# EAGLE board Arduino-Teensy-v5_PLUS_ESP-12E_4LAYER (EAGLE 8.6.0)
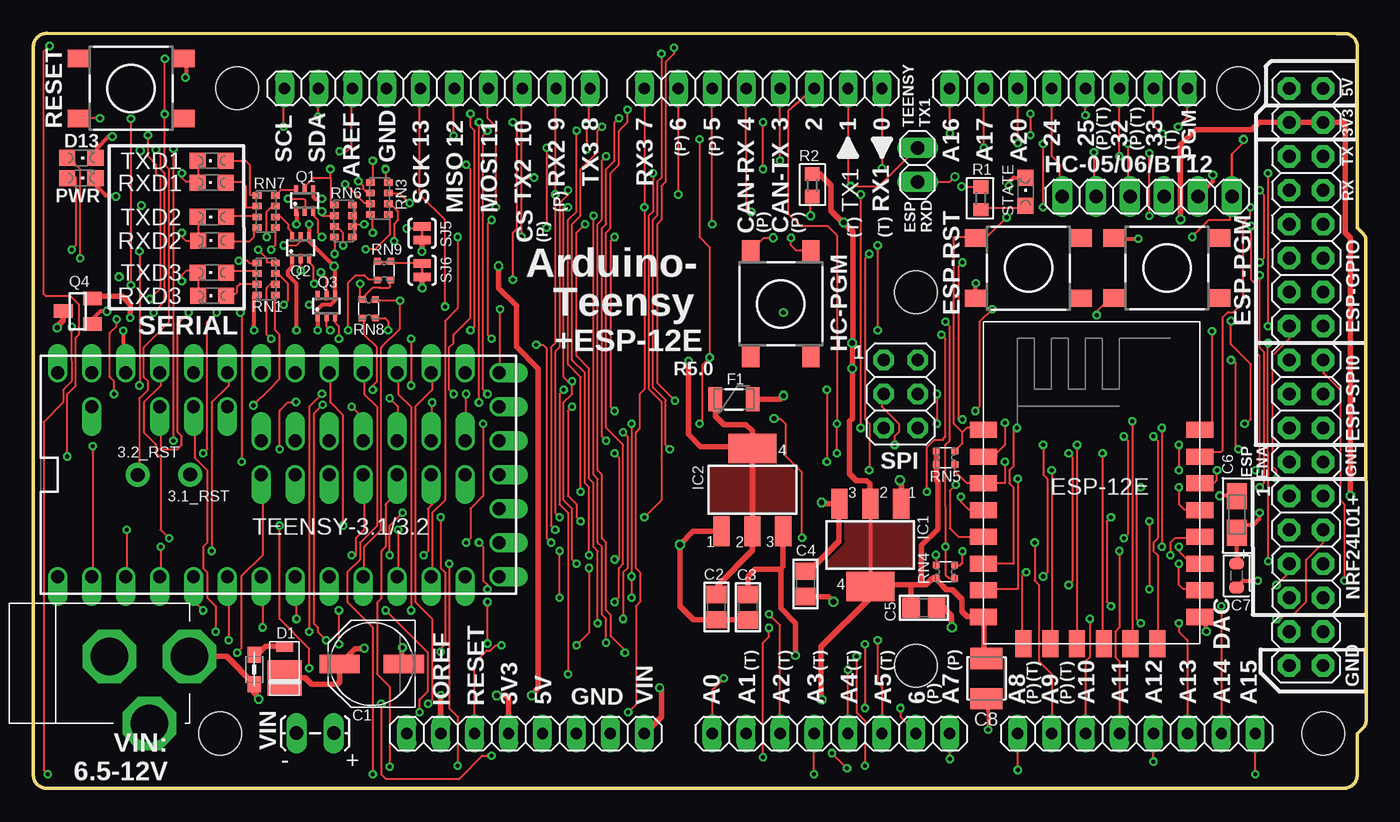
[diagram p1: board, top side]
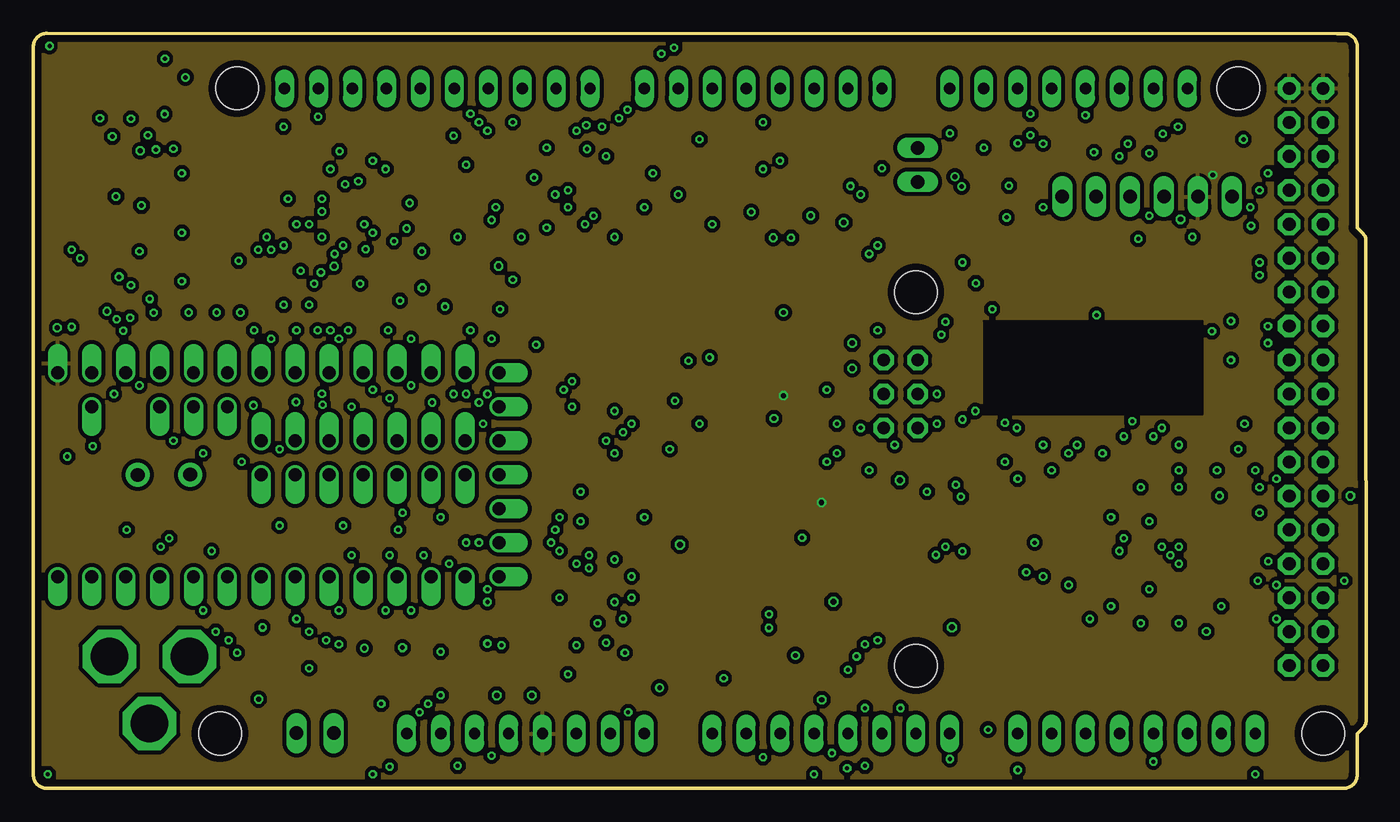
[diagram p2: board, inner layer 5V-FUSE]
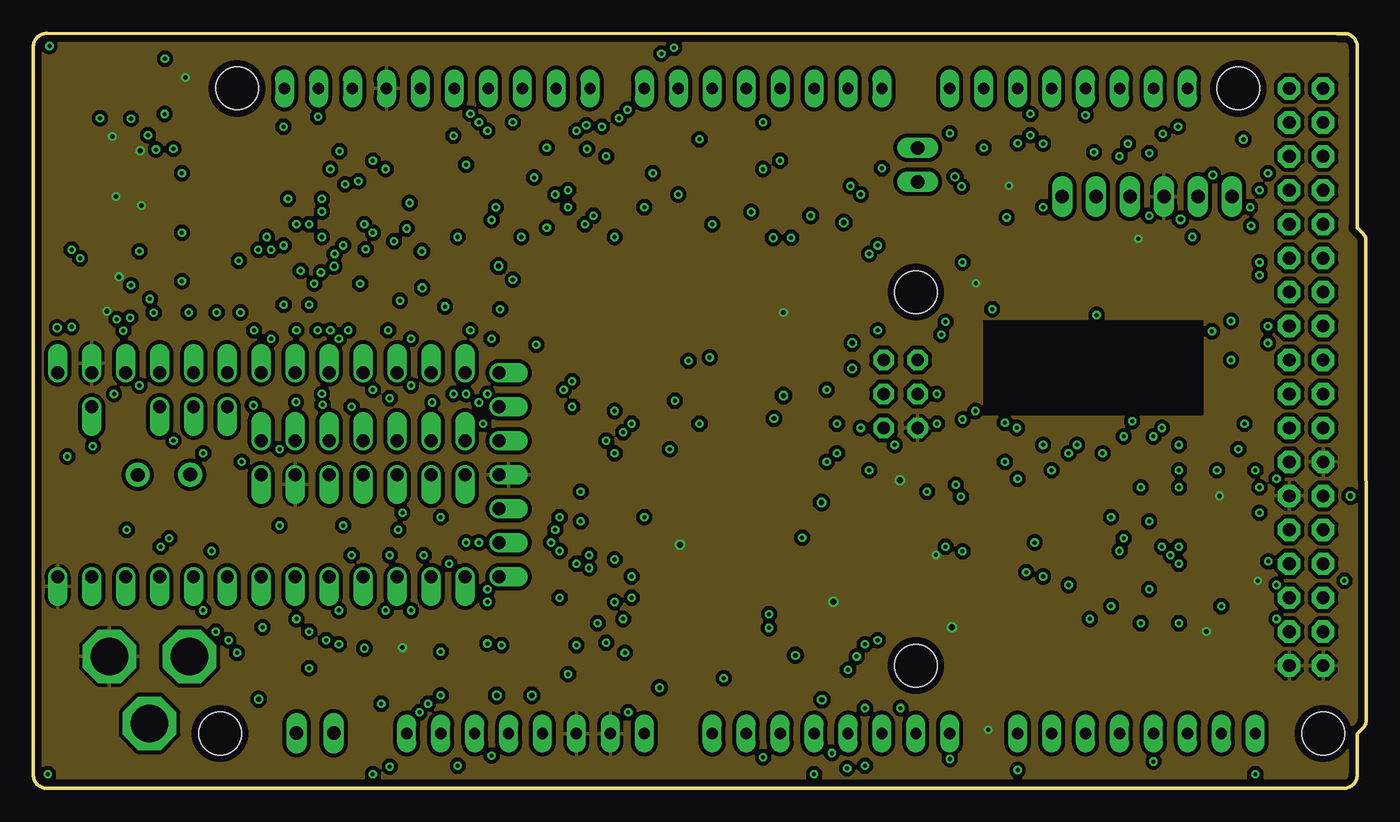
[diagram p3: board, inner layer GND]
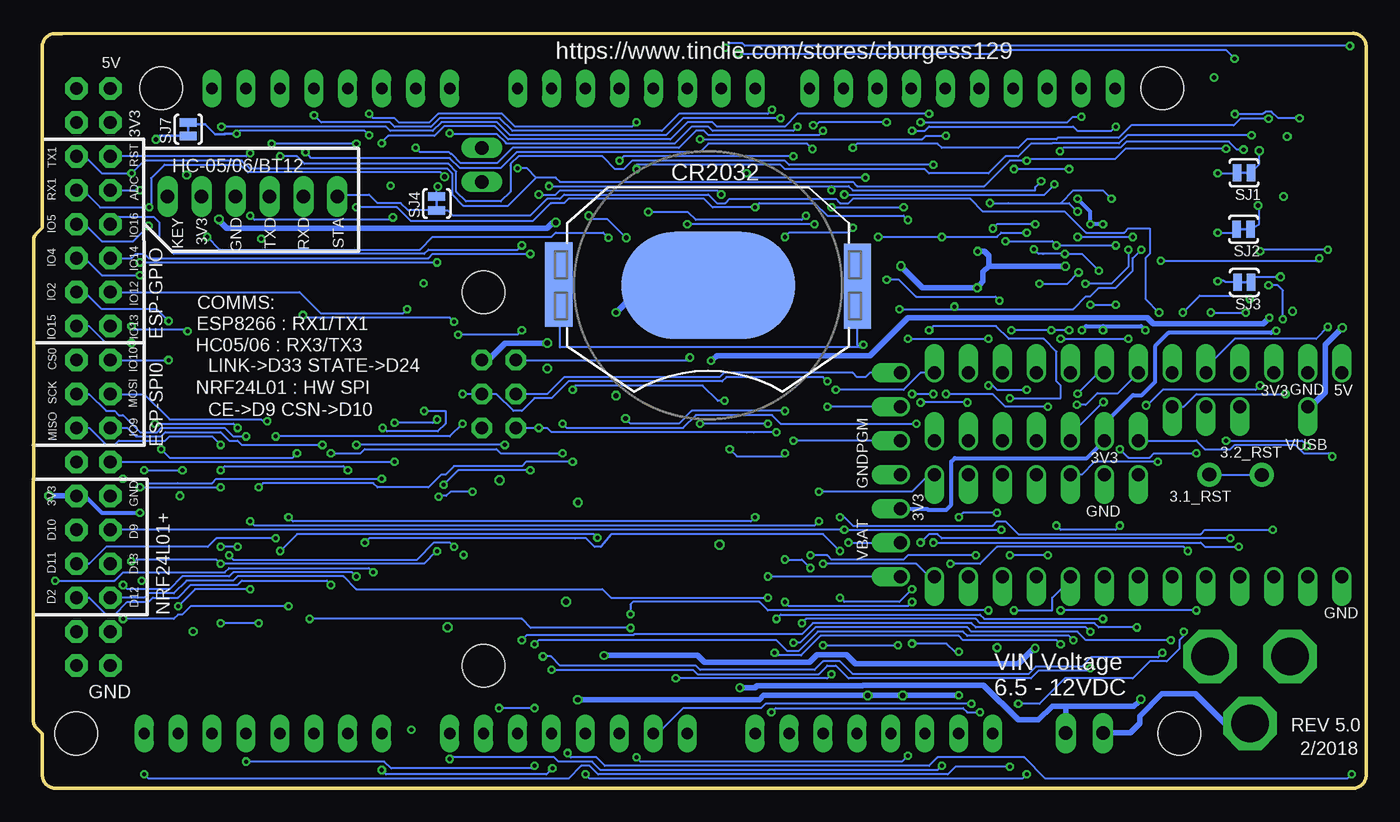
[diagram p4: board, bottom side, seen from below]

Size 99.73 x 56.48 mm. Coordinates in mm from the lower left corner, seen from the top.
Outline: 97.59,56.46 98.06,56.47 arc-91 99.07,55.47 99.06,53.38 99.06,41.95 99.53,41.47 arc-45 99.72,41.03 99.73,5.03 arc-46 99.54,4.58 99.06,4.1 99.06,1 arc-90 98.06,0 1,0 arc-90 0,1 0,55.48 arc-90 1,56.48 97.59,56.46
Copper layers (1*2*15*16): Top 0.035mm / dielectric 0.2mm / 5V-FUSE 0.035mm / dielectric 1.2mm / GND 0.035mm / dielectric 0.2mm / Bottom 0.035mm
Design rules "Elecrow_4-layer_PCB_eagle_rule": minimum track width 6mil, minimum drill 12mil, track to track 6mil, track to pad 6mil, pad to pad 6mil, via to via 8mil, smd to smd 0mil, copper to edge 20mil, drill to drill 10mil, minimum pad ring 6mil, minimum via ring 6mil, stop-mask expansion 0mil, vias tented up to drill 100mil, thermal gap 10mil
Net classes: 0 default: width 0.152 mm, drill 0.305 mm, clearance 0.152 mm; 1 POWER: width 0.305 mm, drill 0.305 mm, clearance 0.203 mm; 2 gnd: width 0.203 mm, drill 0.406 mm, clearance 0.203 mm
Holes 3.2 mm at 96.52,4.1 15.24,52.36 90.17,52.36 13.97,4.1 66.04,37.12 66.04,9.18
tRestrict: area 63.5,6.6 to 68.6,11.7; area 12.7,49.8 to 17.8,54.9; area 63.5,34.6 to 68.6,39.7; area 87.6,49.8 to 92.7,54.9; area 94,1.6 to 99.1,6.6; area 11.4,1.6 to 16.5,6.6
bRestrict: area 63.5,6.6 to 68.6,11.7; area 12.7,49.8 to 17.8,54.9; area 63.5,34.6 to 68.6,39.7; area 87.6,49.8 to 92.7,54.9; area 94,1.6 to 99.1,6.6; area 11.4,1.6 to 16.5,6.6

## Footprints (pad centres in the part's own frame; a part is rotated, then mirrored left to right if it is on the bottom)
1X01-CLEANBIG = drill 1.016 pad 1.778: 1 0,0
PANASONIC_D = smd 3 x 1.4: + 2.4,0; - -2.4,0
0805 = smd 1.3 x 1.5: 1 -0.95,0; 2 0.95,0
A/3216-18R = smd 1.95 x 1.5: + 1.375,0; - -1.375,0
C0603-ROUND = smd 0.898 x 1.1: 1 -0.889,0; 2 0.889,0
SMC_B = smd 1.6 x 2.4: + -1.5,0; - 1.5,0
BATTCON_20MM_4LEGS = smd 13 x 8: NEGATIVE 0,0 | smd 2.032 x 3.175: POSITIVE@1 -11.176,1.651; POSITIVE@2 -11.176,-1.524; POSITIVE@3 11.176,1.524; POSITIVE@4 11.176,-1.651
DO220AAL = smd 2.667 x 2.54: P$1 -0.7,0 | smd 0.762 x 1.27: P$2 1.65,0
CHIPLED_0805 = smd 1.2 x 1.2: A 0,-1.05; C 0,1.05
DTSM-6 = smd 1.55 x 1.3: 1 -3.975,2.25; 2 3.975,2.25; 3 -3.975,-2.25; 4 3.975,-2.25
PTC-1206 = smd 1 x 1.8: 1 -1.4,0; 2 1.4,0
1X06 = drill 1.016 long: 1 -6.35,0; 2 -3.81,0; 3 -1.27,0; 4 1.27,0; 5 3.81,0; 6 6.35,0
SOT223 = smd 1.219 x 2.235: 1 -2.311,-3.099; 2 0,-3.099; 3 2.311,-3.099 | smd 3.6 x 2.2: 4 0,3.099
1X02 = drill 1.016 long: 1 -1.27,0; 2 1.27,0
1X10 = drill 0.85 pad 1.422 long: 1 -11.43,0; 2 -8.89,0; 3 -6.35,0; 4 -3.81,0; 5 -1.27,0; 6 1.27,0; 7 3.81,0; 8 6.35,0; 9 8.89,0; 10 11.43,0
1X08 = drill 0.85 pad 1.422 long: 1 -8.89,0; 2 -6.35,0; 3 -3.81,0; 4 -1.27,0; 5 1.27,0; 6 3.81,0; 7 6.35,0; 8 8.89,0
2X18 = drill 0.95 pad 1.676 octagon: 1 -21.59,-1.27; 2 -21.59,1.27; 3 -19.05,-1.27; 4 -19.05,1.27; 5 -16.51,-1.27; 6 -16.51,1.27; 7 -13.97,-1.27; 8 -13.97,1.27; 9 -11.43,-1.27; 10 -11.43,1.27; 11 -8.89,-1.27; 12 -8.89,1.27; 13 -6.35,-1.27; 14 -6.35,1.27; 15 -3.81,-1.27; 16 -3.81,1.27; 17 -1.27,-1.27; 18 -1.27,1.27; 19 1.27,-1.27; 20 1.27,1.27; 21 3.81,-1.27; 22 3.81,1.27; 23 6.35,-1.27; 24 6.35,1.27; 25 8.89,-1.27; 26 8.89,1.27; 27 11.43,-1.27; 28 11.43,1.27; 29 13.97,-1.27; 30 13.97,1.27; 31 16.51,-1.27; 32 16.51,1.27; 33 19.05,-1.27; 34 19.05,1.27; 35 21.59,-1.27; 36 21.59,1.27
0805' = smd 1.2 x 1: 1 -1.1,0; 2 1.1,0
ESP8266-ESP12E = smd 2 x 1.2: 1 -7.62,5.84; 2 -7.62,3.84; 3 -7.62,1.84; 4 -7.62,-0.16; 5 -7.62,-2.16; 6 -7.62,-4.16; 7 -7.62,-6.16; 8 -7.62,-8.16; 9 8.58,-8.16; 10 8.58,-6.16; 11 8.58,-4.16; 12 8.58,-2.16; 13 8.58,-0.16; 14 8.58,1.84; 15 8.58,3.84; 16 8.58,5.84 | smd 1.2 x 2: 17 -4.62,-10.16; 18 -2.62,-10.16; 19 -0.62,-10.16; 20 1.38,-10.16; 21 3.38,-10.16; 22 5.38,-10.16
SOT363_INFINEON = smd 0.3 x 0.7: 1 -0.65,-0.8; 2 0,-0.8; 3 0.65,-0.8; 4 0.65,0.8; 5 0,0.8; 6 -0.65,0.8
SUPER-SOT3 = smd 1 x 1.4: 1 -0.95,-1.1; 2 0.95,-1.1; 3 0,1.1
R0603 = smd 1 x 1.1: 1 -0.85,0; 2 0.85,0
CAT16 = smd 0.5 x 0.65: 1 -1.2,-0.675; 2 -0.4,-0.675; 3 0.4,-0.675; 4 1.2,-0.675; 5 1.2,0.675; 6 0.4,0.675; 7 -0.4,0.675; 8 -1.2,0.675
EXB34V = smd 0.5 x 0.5: 1 -0.5,-0.7; 2 0.5,-0.7; 3 0.5,0.7; 4 -0.5,0.7
SJ_2S-TRACE = smd 0.635 x 1.27: 1 -0.508,0; 2 0.508,0
2X03 = drill 0.95 pad 1.55 octagon: 1 -2.54,-1.27; 2 -2.54,1.27; 3 0,-1.27; 4 0,1.27; 5 2.54,-1.27; 6 2.54,1.27
TEENSY3_ALL_PINS_&_PADS = drill 0.965 offset: 0 -7.62,13.97; 1 -7.62,11.43; 2 -7.62,8.89; 3 -7.62,6.35; 3.3V 7.62,11.43; 3.3V1 -2.54,-16.51; 3.3V2 2.54,-1.27; 4 -7.62,3.81; 5 -7.62,1.27; 6 -7.62,-1.27; 7 -7.62,-3.81; 8 -7.62,-6.35; 9 -7.62,-8.89; 10 -7.62,-11.43; 11 -7.62,-13.97; 12 -7.62,-16.51; 13 7.62,-16.51; 14/A0 7.62,-13.97; 15/A1 7.62,-11.43; 16/A2 7.62,-8.89; 17/A3 7.62,-6.35; 18/A4 7.62,-3.81; 19/A5 7.62,-1.27; 20/A6 7.62,1.27; 21/A7 7.62,3.81; 22/A8 7.62,6.35; 23/A9 7.62,8.89; 24 0,-3.81; 25 0,-6.35; 26 0,-8.89; 27 0,-11.43; 28 0,-13.97; 29 2.54,-13.97; 30 2.54,-11.43; 31 2.54,-8.89; 32 2.54,-6.35; 33 2.54,-3.81; A10 5.08,6.35; A11 5.08,3.81; A12 0,1.27; A13 2.54,1.27; AGND 7.62,13.97; AREF 5.08,8.89; GND -7.62,16.51; GND1 0,-16.51; GND2 0,-1.27; PGM 2.54,-16.51; RESET/DAC 5.08,-16.51; VBAT -5.08,-16.51; VIN 7.62,16.51; VUSB 5.08,13.97
1X02_LOCK_LONGPADS = drill 1.016 long: 1 -0.127,0; 2 2.667,0
POWERSUPPLY_DC-21MM = drill 2.8 pad 4 octagon: 1 -5.08,-3.353; 2 -0.076,-6.35; 3 -0.076,-0.356

## Placement (x,y rotation side)
3.1_RST  [1X01-CLEANBIG]  11.73,23.47 0 top
3.2_RST  [1X01-CLEANBIG]  7.8,23.46 0 top
C1  47u  [PANASONIC_D]  25.32,9.31 180 top
C2  10uf  [0805]  51.1,13.56 90 top
C3  10uf  [0805]  53.48,13.55 90 top
C4  10uf  [0805]  57.77,15.29 90 top
C5  10uf  [0805]  66.64,13.51 180 top
C6  10uf  [A/3216-18R]  90.04,20.49 270 top
C7  100nf  [C0603-ROUND]  90.04,15.91 90 top
C8  220uf  [SMC_B]  71.31,8.2 270 top
CR2032  20mm coincell  [BATTCON_20MM_4LEGS]  49.24,37.63 0 bottom
D1  SS1P3L  [DO220AAL]  18.8,8.97 90 top
D13  red  [CHIPLED_0805]  3.59,47.17 270 top
ESP-PGM  DTSM-6  [DTSM-6]  84.82,38.93 180 top
ESP-RST  DTSM-6  [DTSM-6]  74.47,38.91 180 top
F1  1A  [PTC-1206]  52.44,29.1 0 top
HC-05/06/BT12  PPPC061LFBN-RC  [1X06]  83.34,44.27 0 top
HC-PGM  DTSM-6  [DTSM-6]  55.94,36.25 90 top
IC1  ZLDO1117G33  [SOT223]  62.64,18.2 180 top
IC2  NCP1117ST50T3G  [SOT223]  53.81,22.34 0 top
JP1  [1X02]  66.17,46.65 90 top
JP4  10x1F-H8.5  [1X10]  30.23,52.36 180 top
JP5  8x1F-H8.5  [1X08]  54.61,52.36 180 top
JP6  8x1F-H8.5  [1X08]  77.47,52.36 0 top
JP8  18x2F-H8.5  [2X18]  95.25,30.77 270 top
JP9  8x1F-H8.5  [1X08]  59.69,4.1 0 top
JP10  8x1F-H8.5  [1X08]  82.55,4.1 0 top
JP11  8x1F-H8.5  [1X08]  36.83,4.1 0 top
L1  MH2029-300Y  [0805']  16.54,8.89 270 top
LED10  Yellow  [CHIPLED_0805]  74.24,44.64 0 top
MDL1  ESP8266-12E)  [ESP8266-ESP12E]  78.71,20.98 0 top
PWR  green  [CHIPLED_0805]  3.59,45.66 270 top
Q1  BSD223P  [SOT363_INFINEON]  20.29,43.98 0 top
Q2  BSD223P  [SOT363_INFINEON]  20,40.45 0 top
Q3  BSD223P  [SOT363_INFINEON]  21.93,36.08 0 top
Q4  FDN340P  [SUPER-SOT3]  3.33,35.7 90 top
R1  1K  [R0603]  70.9,44.13 90 top
R2  4.7k  [R0603]  58.29,45.12 90 top
RESET  DTSM-6  [DTSM-6]  7.32,52.36 0 top
RN1  1k  [CAT16]  17.42,38.11 270 top
RN3  10k  [CAT16]  25.9,44.13 270 top
RN4  10K  [EXB34V]  68.25,16.21 90 top
RN5  10K  [EXB34V]  68.26,24.74 90 top
RN6  22K  [CAT16]  23.2,42.44 90 top
RN7  1k  [CAT16]  17.42,43.15 270 top
RN8  10K  [EXB34V]  25.1,35.88 0 top
RN9  22K  [EXB34V]  26.25,38.73 180 top
RXD1  amber  [CHIPLED_0805]  13.35,45.31 90 top
RXD2  amber  [CHIPLED_0805]  13.37,40.98 90 top
RXD3  amber  [CHIPLED_0805]  13.39,36.86 90 top
SJ1  SOLDERJUMPERTRACE  [SJ_2S-TRACE]  9.13,46.05 180 bottom
SJ2  SOLDERJUMPERTRACE  [SJ_2S-TRACE]  9.17,41.83 180 bottom
SJ3  SOLDERJUMPERTRACE  [SJ_2S-TRACE]  9.11,37.85 180 bottom
SJ4  SOLDERJUMPERTRACE  [SJ_2S-TRACE]  69.55,43.75 90 bottom
SJ5  SOLDERJUMPERTRACE  [SJ_2S-TRACE]  29.08,41.52 270 top
SJ6  SOLDERJUMPERTRACE  [SJ_2S-TRACE]  29.1,38.76 90 top
SJ7  SOLDERJUMPERTRACE  [SJ_2S-TRACE]  88.14,49.31 90 bottom
SPI  3x2M  [2X03]  64.9,29.5 270 top
TEENSY-3.1/3.2  TEENSY_3.1_ALL_PINS_AND_PADS  [TEENSY3_ALL_PINS_&_PADS]  18.33,23.46 90 top
TXD1  amber  [CHIPLED_0805]  13.35,46.95 90 top
TXD2  amber  [CHIPLED_0805]  13.36,42.75 90 top
TXD3  amber  [CHIPLED_0805]  13.36,38.58 90 top
VIN  [1X02_LOCK_LONGPADS]  19.81,4.13 0 top
X1  POWERSUPPLY_DC21MMX  [POWERSUPPLY_DC-21MM]  5.33,9.94 90 top

## Tracks (layer width: path | path; a pad name or v marks a point on that pad's centre or on a via)
5V-FUSE  (via drill 0.35, 0.4)
  Top 0.305: C4.2 58.04,16.24 | 60.3,21.27 IC1.3 | HC-05/06/BT12.5 88.27,45.39 v88.27,45.89
  Top 0.406: IC1.3 59.07,21.3 v58.98,21.39 | 58.04,16.24 60.3,18.5 60.3,21.27 | F1.2 55.85,29.1 v56.13,29.38
  pour 5V-FUSE (isolate 0.305, rank 2): 0.83,56.52 98.82,56.54 arc-90 99.82,55.54 99.71,1 arc-90 98.73,0 0.04,0 -0.17,55.51 arc-90
+3V3  (via drill 0.3, 0.35, 0.4)
  Top 0.305: v61.28,33.31 61.34,33.38 | 90.17,17.44 C7.2 C6.+ | v20.64,42.2 20.64,41.25 Q2.4 20.64,40.93 22.52,39.05 | v19.68,42.2 19.68,43.16 Q1.1 | 20.95,44.74 Q1.4 20.95,44.24 21.08,44.11 v21.59,44.11 | v16.51,34.27 16.51,36.8 RN1.4 | v21.27,34.27 21.27,35.22 Q3.1 21.27,35.53 21.27,35.85 21.59,36.17 22.23,36.17 22.58,36.53 Q3.4 22.58,38.99 22.52,39.05 | v19.68,34.27 19.68,37.76 19.05,38.39 19.05,38.71 19.37,39.03 19.37,39.34 Q2.1 | v22.5,39.05 22.52,39.05 | v59,6.63 58.95,6.63 | 71.12,12.68 MDL1.8 | 71.12,9.82 C8.+ | 70.8,12.68 MDL1.8 | MDL1.8 70.86,12.82 | 70.85,12.82 MDL1.8 | IC1.2 62.64,21.12 IC1.4 | IC1.4 62.62,15.09 62.62,14.25 | 62.75,15.21 IC1.4 | 66.47,15.28 66.4,15.21 | 65.68,13.26 C5.2 | R2.2 58.84,45.97 | 65.69,15.12 65.79,15.21 | 90.66,19.72 91.31,19.72 91.76,20.17 v91.76,20.61
  Top 0.406: 61.34,33.38 61.34,41.63 v60.64,42.33 60.58,42.33 59.69,43.22 59.69,45.12 58.84,45.97 | v98.55,21.88 98.55,41.19 98.17,41.57 98.17,49.63 97.98,49.82 JP8.4 JP8.3 91.76,49.82 91.44,49.51 91.41,49.51 91.19,49.29 86.99,49.29 85.84,48.13 v85.84,42.57 | v34.67,6.96 35.34,6.96 35.57,6.73 JP11.4 | JP11.2 v30.48,6.96 | v37.3,6.96 37.3,7 37.78,7.48 37.78,31.41 36.14,33.05 36.14,36.09 34.81,37.43 v34.81,39.07 | v61.28,33.31 v61.28,31.41 61.28,27.66 61.09,27.47 61.09,23.53 61.59,23.03 62.36,23.03 62.61,22.77 62.61,21.15 62.64,21.12 | SJ6.1 v29.1,37.44 | SJ5.2 v29.07,40.17 | 71.12,9.82 71.12,12.68 | 62.75,15.21 65.79,15.21 66.4,15.21 66.8,15.21 67.29,15.71 RN4.4 68.06,15.1 68.31,14.85 68.76,14.85 69.47,14.14 69.47,13.25 69.89,12.82 MDL1.8 | 66.47,15.28 66.47,18.17 67.69,19.4 67.69,22.97 67.56,23.1 67.56,24.17 67.51,24.11 RN5.4 RN5.3 | 62.62,14.25 58.95,10.58 58.95,6.68 v59,6.63 | C5.2 65.69,15.12 | C6.+ 90.66,19.72
  Bottom 0.305: v91.76,20.61 94.61,20.61 95.89,21.88 | v19.68,42.2 v20.64,42.2 20.64,43.16 v21.59,44.11 | v16.51,34.27 16.83,34.58 19.68,34.58 | 19.68,34.58 20.95,34.58 v21.27,34.27 | 19.68,34.58 v19.68,34.27 | v34.81,39.07 34.85,39.1
  Bottom 0.406: v61.28,33.31 64.45,33.31 65.72,32.04 SPI.2 | 95.89,21.88 JP8.26 v98.55,21.88 | v60.64,42.33 60.87,42.33 61.3,41.9 85.27,41.91 85.84,42.48 v85.84,42.57 | v30.48,6.96 v34.67,6.96 v37.3,6.96 45.09,6.96 45.4,6.64 v59,6.63 | v22.5,39.05 28.25,39.05 | 28.25,39.05 28.68,38.63 28.66,37.95 v29.1,37.44 33.2,37.45 v34.81,39.07 | 28.25,39.05 28.25,39.84 28.57,40.17 28.91,40.17 v29.07,40.17
  pour Top: 64.4,16.27 64.4,16.56 65.77,16.56 65.77,16.68 65.79,16.68 65.79,19.82 59.54,19.82 59.54,16.56 60.91,16.56 60.91,16.27
+5V  (via drill 0.3)
  Top 0.305: 4.45,36.8 Q4.2 | IC2.2 53.81,18.76 53.82,18.75
  Top 0.406: 4.45,36.8 6.67,36.8 6.99,36.49 7.24,36.21 v7.24,35.22 | C2.2 51.18,15.16 53.82,17.81 53.82,18.75 | 53.81,25.24 IC2.2 | 53.81,25.24 IC2.4 53.81,26.75 53.34,27.22 51.69,27.22 51.05,27.85 51.05,29.08 F1.1 | 53.81,25.24 53.54,24.97 | 53.81,25.24 53.48,25.57 49.94,25.57 49.02,26.48 v49.02,31.98
  Bottom 0.406: v7.24,35.22 7.68,34.77 15.94,34.77 16.38,35.22 34.29,35.22 37.15,32.36 48.58,32.36 48.64,32.3 49.02,32.04 v49.02,31.98
  pour Top: 52.07,24.27 52.07,23.98 50.7,23.98 50.7,23.86 50.69,23.86 50.69,20.71 56.93,20.71 56.93,23.98 55.56,23.98 55.56,24.27
AD0/A-SCK  (via drill 0.3)
  Top 0.152: v51.66,8.23 50.99,7.54 50.8,7.35 JP9.1 | v40.01,8.55 40.01,20.61 39.37,21.25 39.37,29.5 v39.69,29.82
  Bottom 0.152: v40.01,8.55 40.32,8.23 v51.66,8.23 | v39.69,29.82 34.61,29.82 33.34,31.09 32.38,31.09 TEENSY-3.1/3.2.14/A0
AD1  (via drill 0.3)
  Top 0.152: v29.53,6.33 29.84,6.64 29.84,12.68 28.57,13.95 28.57,28.55 29.84,29.82 29.84,30.77 TEENSY-3.1/3.2.15/A1
  Bottom 0.152: JP9.2 53.02,4.1 51.12,6.01 45.28,6.01 44.96,6.33 v29.53,6.33
AD2  (via drill 0.3)
  Top 0.152: v28.26,13.31 28.26,28.55 27.3,29.5 27.3,30.77 TEENSY-3.1/3.2.16/A2 | JP9.3 55.88,12.21 v55.05,13.03
  Bottom 0.152: v28.26,13.31 44.77,13.31 45.4,13.95 54.88,13.95 55.05,13.77 v55.05,13.03
AD3  (via drill 0.3)
  Top 0.152: v58.42,1.05 JP9.4 | v25.4,1.05 25.4,12.04 23.5,13.95 23.5,16.17 24.45,17.12 24.45,18.39 25.72,19.66 25.72,28.55 24.77,29.5 24.77,30.77 TEENSY-3.1/3.2.17/A3
  Bottom 0.152: v58.42,1.05 58.1,0.74 25.72,0.74 v25.4,1.05
AD6/CS1  (via drill 0.3)
  Top 0.152: v64.9,6.01 64.9,5.37 66.04,4.23 JP9.7 | v62.23,10.77 v62.23,6.01 | v21.91,11.09 21.27,11.72 21.27,12.04 20.98,12.36 20.98,28.03 v21.64,28.69
  Bottom 0.152: v62.23,6.01 v64.9,6.01 | v62.23,10.77 61.91,11.09 44.13,11.09 43.31,10.26 42.48,10.26 41.02,11.72 30.16,11.72 29.84,11.4 22.23,11.4 v21.91,11.09 | v21.64,28.69 20.98,28.69 20.1,29.57 18.57,29.57 TEENSY-3.1/3.2.20/A6
AD7  (via drill 0.3)
  Top 0.152: v68.58,2.2 JP9.8 | v31.75,1.69 31.75,5.37 31.11,6.01 v31.11,16.8 | v13.34,17.75 13.34,28.87 14.61,30.14 14.61,30.77 TEENSY-3.1/3.2.21/A7
  Bottom 0.152: v68.58,2.2 68.45,2.32 60.77,2.32 60.45,2.01 57.91,2.01 57.28,1.37 32.07,1.37 v31.75,1.69 | v31.11,16.8 28.89,16.8 27.62,18.07 13.65,18.07 v13.34,17.75
AD8  (via drill 0.3)
  Top 0.152: v73.66,1.37 JP10.1 | v59.75,2.64 v60.9,1.5 | v1.08,1.05 0.76,1.37 0.76,27.41 2.22,28.87 2.22,29.82 2.86,30.45 2.85,33.46 2.85,34.4 v2.86,34.52
  Bottom 0.152: v73.66,1.37 73.34,1.05 61.34,1.05 v60.9,1.5 | v1.08,1.05 1.4,0.74 24,0.74 25.59,2.32 32.07,2.32 32.7,1.69 56.96,1.69 57.59,2.32 59.5,2.32 59.69,2.52 v59.75,2.64 | TEENSY-3.1/3.2.22/A8 11.75,31.09 11.43,31.09 11.43,32.04 9.84,33.63 3.75,33.63 v2.86,34.52
AD9  (via drill 0.3)
  Top 0.152: JP10.2 76.2,8.55 75.25,9.5 75.25,15.21 74.93,15.53 v74.93,18.39 | v39.37,14.26 v39.37,17.75 | v33.97,14.9 33.97,15.21 33.66,15.53 33.66,18.07 v33.34,18.39 | v10.16,18.71 9.53,19.34 9.53,24.74 9.21,25.06 9.21,25.69 8.26,26.64 8.26,28.87 9.53,30.14 9.53,30.77 TEENSY-3.1/3.2.23/A9
  Bottom 0.152: v74.93,18.39 74.61,18.71 59.22,18.71 | 59.22,18.71 59.17,18.71 | v39.37,17.75 40.64,19.02 56.52,19 57.29,18.07 57.73,18.07 58.38,18.72 59.21,18.72 59.22,18.71 | v39.37,14.26 39.05,13.95 34.92,13.95 v33.97,14.9 | v33.34,18.39 32.7,19.02 32.07,19.02 31.75,18.71 v10.16,18.71
AD10  (via drill 0.3)
  Top 0.152: JP10.3 78.74,9.5 79.06,9.82 v79.06,12.68 | v26.04,6.33 26.04,1.05 26.35,0.74 31.88,0.74 33.59,2.45 v34.29,2.45 | v13.65,11.72 13.65,13.63 13.02,14.26 13.02,16.17 12.7,16.48 12.7,18.07 13.02,18.39 13.02,23.79 12.06,24.74 12.06,28.23 TEENSY-3.1/3.2.A10 | v55.04,12 55.05,11.99 55.05,11.35 54.61,10.91 v54.61,2.32
  Bottom 0.152: v79.06,12.68 63.18,12.68 62.51,12 v55.04,12 | v54.61,2.32 54.29,2.01 34.73,2.01 v34.29,2.45 | v26.04,6.33 24.45,6.33 22.54,8.23 17.46,8.23 16.19,9.5 14.92,9.5 13.97,10.45 13.97,11.09 13.65,11.4 v13.65,11.72
AD11  (via drill 0.3, 0.35)
  Top 0.152: JP10.4 81.28,9.5 80.96,9.82 80.96,11.72 81.28,12.04 v81.28,17.75 | v43.5,28.23 43.18,28.55 43.18,40.93 v43.5,41.25 | v38.42,47.92 v38.42,41.95 | v7.3,37.63 v7.3,50.1 | v6.03,29.5 6.03,30.45 5.71,30.77 5.71,34.07 6.22,34.58 v6.22,35.09 | v55.42,27.67 55.48,27.61 55.94,27.61 56.33,27.23 56.33,24.84 57.53,23.64 v57.53,18.75
  Bottom 0.152: v81.28,17.75 80.01,19.02 57.92,19.02 57.8,19.01 v57.53,18.75 | v43.5,41.25 43.18,41.57 38.73,41.57 38.48,41.82 v38.42,41.95 | v38.42,47.92 38.1,48.23 32.07,48.23 31.75,47.92 26.04,47.92 25.4,48.55 23.18,48.55 23.08,48.65 18.51,48.65 17.57,49.59 9.91,49.59 9.41,50.1 v7.3,50.1 | v7.3,37.63 6.6,37.63 6.22,37.25 v6.22,35.09 | v6.03,29.5 12.7,29.5 13.65,28.55 14.29,28.55 TEENSY-3.1/3.2.A11 | v55.42,27.67 55.04,27.28 51.44,27.28 50.48,28.23 v43.5,28.23
AD12  (via drill 0.3)
  Top 0.152: v83.82,2.01 JP10.5 | v62.23,1.69 62.23,5.06 61.59,5.69 v61.61,9.87 | v15.24,10.13 15.56,10.45 15.56,15.85 17.14,17.44 17.14,23.15 TEENSY-3.1/3.2.A12
  Bottom 0.152: v83.82,2.01 73.47,2.01 72.96,1.5 62.42,1.5 v62.23,1.69 | v61.61,9.87 61.01,9.87 60.33,9.18 50.16,9.18 49.85,8.87 41.27,8.87 40.64,9.5 39.37,9.5 38.42,8.55 25.27,8.55 24.71,9.11 21.28,9.11 20.58,9.8 15.57,9.8 v15.24,10.13
AD13  (via drill 0.3)
  Top 0.152: JP10.6 86.36,11.09 85.72,11.72 v85.72,12.36 | v82.87,12.36 82.55,12.68 82.55,22.2 v82.87,22.52 | v59.37,29.82 v59.37,24.42 | v47.94,55.41 47.94,54.97 47.31,54.33 47.31,45.38 46.99,45.06 46.99,42.52 46.67,42.2 46.67,30.33 v48.01,28.99 | v1.21,55.54 0.76,55.09 0.76,37 0.95,36.8 2.79,36.8 3.39,36.21 3.39,33.92 3.17,33.7 3.17,30.14 2.54,29.5 v2.54,24.83
  Bottom 0.152: v82.87,12.36 v85.72,12.36 | v82.87,22.52 82.55,22.84 74.3,22.84 73.98,22.52 70.17,22.52 69.22,23.47 68.9,23.47 68.26,24.11 63.18,24.11 62.87,24.42 v59.37,24.42 | v59.37,29.82 59.44,29.88 59.18,30.14 49.66,30.14 48.51,28.99 v48.01,28.99 | v47.94,55.41 47.62,55.73 46.67,55.73 46.48,55.54 v1.21,55.54 | TEENSY-3.1/3.2.A13 16.83,26.01 12.7,26.01 12.06,25.37 10.16,25.37 9.84,25.69 5.29,25.69 4.67,25.07 2.78,25.07 v2.54,24.83
AD14/DAC  (via drill 0.3)
  Top 0.152: v88.9,13.63 JP10.7 | v83.5,19.98 v83.5,14.9 | v40.96,19.98 40.64,20.3 40.64,21.25 40.01,21.88 40.01,28.23 v40.32,28.55
  Bottom 0.152: v88.9,13.63 87.63,14.9 v83.5,14.9 | v83.5,19.98 83.19,19.66 41.27,19.66 v40.96,19.98 | v40.32,28.55 34.92,28.55 TEENSY-3.1/3.2.RESET/DAC
AD15  (via drill 0.3)
  Top 0.152: v91.44,1.05 JP10.8 | v26.67,1.63 26.67,7.59 25.72,8.55 25.72,13.88 26.04,14.2 26.04,17.75 26.35,18.07 26.35,21.25 27.3,22.2 27.3,23.15 TEENSY-3.1/3.2.26
  Bottom 0.152: v91.44,1.05 91.12,0.74 59.69,0.74 58.74,1.69 58.1,1.69 57.47,1.05 31.3,1.05 30.73,1.63 v26.67,1.63
AD16  (via drill 0.3)
  Top 0.152: v68.58,49 JP6.1 | v42.55,49.51 42.23,49.19 42.23,47.6 40.96,46.33 40.96,42.84 40.32,42.2 40.32,32.04 41.27,31.09 41.27,22.84 41.59,22.52 v41.59,17.44 | v29.21,17.44 29.53,17.75 29.53,20.93 29.84,21.25 29.84,23.15 TEENSY-3.1/3.2.27
  Bottom 0.152: v42.55,49.51 42.86,49.19 48.9,49.19 49.21,49.51 50.48,49.51 51.75,48.23 64.33,48.23 64.41,48.32 64.41,48.33 65.02,48.93 68.52,48.93 v68.58,49 | v41.59,17.44 40.32,17.44 40.01,17.12 34.61,17.12 34.29,17.44 v29.21,17.44
AD17  (via drill 0.3)
  Top 0.152: v71.12,47.92 JP6.2 | v40.64,49.19 40.64,43.16 40.01,42.52 40.01,31.73 40.96,30.77 v40.96,22.2
  Bottom 0.152: v71.12,47.92 70.8,47.6 68.64,47.6 68.5,47.46 68.45,47.46 67.77,46.77 65.02,46.77 63.88,47.92 51.44,47.92 50.16,49.19 49.53,49.19 49.21,48.87 40.96,48.87 v40.64,49.19 | v40.96,22.2 33.97,22.2 32.7,23.47 32.38,23.47 TEENSY-3.1/3.2.28
AD20  (via drill 0.3)
  Top 0.152: v73.66,48.26 JP6.3 | v32.7,50.46 32.7,49.51 33.02,49.19 33.02,34.58 v32.7,34.27 | v26.67,29.18 27.3,28.55 27.3,26.01 TEENSY-3.1/3.2.31
  Bottom 0.152: 73.66,48.48 v73.66,48.26 73.66,48.32 73.18,48.81 69.72,48.81 69,49.53 65.19,49.53 64.21,48.55 52.07,48.55 50.8,49.82 48.9,49.82 48.58,49.51 43.5,49.51 42.55,50.46 v32.7,50.46 | v32.7,34.27 32.38,34.58 27.69,34.58 26.73,33.63 24.13,33.63 23.18,32.68 23.18,30.45 22.86,30.14 22.86,29.18 v26.67,29.18
ADC  (via drill 0.3)
  Top 0.152: v72.71,27.34 72.71,25.69 72.07,25.06 72.07,24.74 71.12,24.74 MDL1.2 | v69.53,27.6 69.22,27.6 69.22,39.03 v69.53,39.34 | v91.76,39.34 92.08,39.66 92.08,44.42 v91.76,44.74
  Bottom 0.152: v69.53,27.6 69.6,27.6 69.85,27.34 v72.71,27.34 | v91.76,39.34 v69.53,39.34 | JP8.7 v91.76,44.74
AREF  (via drill 0.3)
  Top 0.152: v22.91,47.66 23.46,47.66 23.81,48.02 23.81,52.36 JP4.8 | v9.17,47.79 9.53,47.42 9.53,46.33 9.84,46.01 9.84,36.42 v9,35.59 | v11.62,35.6 10.79,34.77 10.79,26.64 11.11,26.33 11.11,25.69 10.79,25.37 9.53,25.37 9.53,28.23 TEENSY-3.1/3.2.AREF
  Bottom 0.152: v11.62,35.6 11.61,35.59 v9,35.59 | v9.17,47.79 9.67,47.79 10.26,48.37 17.93,48.37 18.37,47.93 22.64,47.93 v22.91,47.66
CANRX/PWM4  (via drill 0.3)
  Top 0.152: v53.72,43.12 53.63,43.12 53.35,43.4 JP5.5 | v41.91,42.84 41.91,23.47 42.23,23.15 42.23,18.39 42.55,18.07 42.55,12.99 42.86,12.68 v42.86,10.9 | v14.61,11.09 14.61,15.53 TEENSY-3.1/3.2.4
  Bottom 0.152: v53.72,43.12 50.76,43.12 50.16,42.52 42.23,42.52 v41.91,42.84 | v14.61,11.09 20.95,11.09 21.59,11.72 29.53,11.72 29.84,12.04 41.21,12.04 42.35,10.9 v42.86,10.9
CANTX/PWM3  (via drill 0.3)
  Top 0.152: v55.88,46.97 JP5.4 | v42.86,47.28 42.55,46.97 42.55,42.52 42.23,42.2 42.23,23.79 42.55,23.47 42.55,18.71 42.86,18.39 42.86,13.31 43.18,12.99 43.18,11.4 44.26,10.33 v44.26,10.13 | v22.86,13.31 v22.86,10.77 | v12.7,13.31 12.06,13.95 12.06,15.53 TEENSY-3.1/3.2.3
  Bottom 0.152: v55.88,46.97 55.56,47.28 v42.86,47.28 | v44.26,10.13 44.07,9.94 42.29,9.94 40.83,11.4 30.48,11.4 30.16,11.09 23.18,11.09 v22.86,10.77 | v12.7,13.31 v22.86,13.31
CH_PD  (via drill 0.3)
  Top 0.152: v72.71,24.42 72.71,22.84 71.12,22.84 MDL1.3 70.8,22.84 69.85,22.84 68.96,23.72 RN5.1
  Bottom 0.152: JP8.23 v72.71,24.42
D2  (via drill 0.3)
  Top 0.152: JP5.3 56.52,50.71 56.52,42.96 57.4,42.08 59.44,42.08 60.13,41.38 v60.13,27.28 v60.13,25.06 | v77.47,25.06 77.79,24.74 77.79,15.53 v77.47,15.21 | v9.53,18.07 9.53,15.85 TEENSY-3.1/3.2.2 | v32.38,18.39 32.7,18.71 32.7,20.93 33.66,21.88 v33.66,27.28
  Bottom 0.152: v60.13,25.06 64.77,25.06 65.09,25.37 74.93,25.37 75.25,25.06 v77.47,25.06 | v77.47,15.21 77.79,15.53 84.14,15.53 84.45,15.21 87.95,15.21 88.9,14.26 90.81,14.26 91.12,13.95 92.71,13.95 93.66,12.99 94.3,12.99 95.57,14.26 JP8.32 | v9.53,18.07 12.06,18.07 12.38,18.39 v32.38,18.39 | v33.66,27.28 43.81,27.28 44.45,27.91 50.16,27.91 51.12,26.96 59.82,26.96 v60.13,27.28
D8/TX3/A-MISO  (via drill 0.3)
  Top 0.152: RN8.3 25.72,36.49 v27.43,36.49 27.43,34.39 26.04,33 26.04,19.34 24.77,18.07 24.77,15.85 TEENSY-3.1/3.2.8 | v35.88,49.82 36.2,49.51 36.2,41.88 35.88,41.57 v35.88,38.06 | JP4.1 41.59,52.36 41.59,49.86 41.38,49.64 v41.38,49.62 41.38,48.49 41.43,48.44 v41.43,47.83 | v79.38,47.6 79.38,44.42 HC-05/06/BT12.2
  Bottom 0.152: v35.88,49.82 40.96,49.82 41.16,49.62 v41.38,49.62 | v35.88,38.06 34.96,38.06 33.68,36.78 27.72,36.78 v27.43,36.49 | v79.38,47.6 79.15,47.38 79.06,47.28 78.93,47.16 68.58,47.16 67.82,46.39 64.77,46.39 63.56,47.6 49.85,47.6 49.21,48.23 41.83,48.23 v41.43,47.83
D11/DOUT/MOSI  (via drill 0.3)
  Top 0.152: v34.61,43.47 34.61,49.51 33.97,50.14 33.97,52.36 JP4.4 | v40.01,43.47 39.69,43.47 39.69,30.77 40.32,30.14 | 40.32,30.14 40.32,29.5 39.69,28.87 39.69,21.57 40.32,20.93 40.32,17.12 v40.64,16.8 | 40.32,30.14 v40.32,30.45 | v81.6,18.71 81.92,19.02 81.92,26.01 v81.6,26.33 | v67.63,29.5 v67.63,27.28
  Bottom 0.152: v40.01,43.47 v34.61,43.47 | v40.64,16.8 33.66,16.8 32.7,15.85 32.38,15.85 TEENSY-3.1/3.2.11 | v40.32,30.45 40.64,30.77 47.88,30.77 48.2,30.45 59.69,30.45 60.96,29.18 62.23,29.18 63.18,28.23 63.82,28.23 65.09,29.5 SPI.4 v67.63,29.5 | JP8.30 95.57,16.8 94.3,18.07 86.68,18.07 86.04,18.71 v81.6,18.71 | v81.6,26.33 68.58,26.33 v67.63,27.28
D12/DIN/MISO  (via drill 0.3)
  Top 0.152: v31.43,48.82 31.43,52.36 JP4.5 | v44.77,27.28 v44.77,15.85 v44.77,14.26 | v49.85,27.28 50.04,27.47 50.04,31.66 v50.61,32.23 50.61,40.49 49.85,41.25 v49.85,48.55
  Bottom 0.152: v49.85,48.55 33.21,48.57 32.96,48.82 v31.43,48.82 | v50.61,32.23 50.8,32.04 SPI.1 | v44.77,15.85 34.92,15.85 TEENSY-3.1/3.2.12 | JP8.31 91.44,14.26 91.12,14.58 89.22,14.58 88.27,15.53 84.77,15.53 84.45,15.85 76.52,15.85 75.56,14.9 57.15,14.9 56.52,14.26 v44.77,14.26 | v44.77,27.28 v49.85,27.28
D13/SCK  (via drill 0.3)
  Top 0.152: v16.83,40.3 17.46,39.66 17.46,39.34 18.1,39.34 RN1.8 | v34.92,35.85 34.92,31.09 TEENSY-3.1/3.2.13 | v30.8,36.04 30.8,42.52 28.89,44.42 28.89,52.36 JP4.6 | JP8.29 93.98,16.17 v93.03,15.21 | v75.56,15.85 75.88,16.17 75.88,23.15 75.56,23.47 v75.56,25.69 | v64.45,25.69 64.45,26.33 64.77,26.64 64.77,27.28 63.5,28.55 63.5,29.5 SPI.3
  Bottom 0.152: v16.83,40.3 17.46,39.66 17.46,38.71 18.73,37.44 20,37.44 20.64,36.8 20.95,36.8 21.91,35.85 30.8,35.85 | v34.92,35.85 30.8,35.85 | 30.8,35.85 v30.8,36.04 | SPI.3 61.28,29.5 60.01,30.77 48.39,30.77 48.07,31.09 38.42,31.09 38.1,30.77 37.47,30.77 37.15,31.09 34.92,31.09 TEENSY-3.1/3.2.13 | v93.03,15.21 92.71,14.9 89.53,14.9 88.58,15.85 85.09,15.85 84.77,16.17 75.88,16.17 v75.56,15.85 | v64.45,25.69 v75.56,25.69
D24  (via drill 0.3)
  Top 0.152: JP6.4 76.2,47.28 76.83,46.65 76.83,44.42 HC-05/06/BT12.1 | v15.49,35.6 15.61,35.51 15.58,35.48 v15.58,24.42
  Bottom 0.152: v15.58,24.42 20.32,24.42 21.27,23.47 21.91,23.47 TEENSY-3.1/3.2.24 | v15.49,35.6 16.51,36.61 16.51,39.66 16.19,39.98 16.19,41.88 17.78,41.88 18.1,41.57 20.95,41.57 22.54,43.16 28.66,43.16 29.62,44.11 38.42,44.11 38.73,43.79 39.37,43.79 39.69,44.11 47.62,44.11 47.94,43.79 48.58,43.79 49.21,44.42 60.01,44.42 60.33,44.11 61.28,44.11 62.55,42.84 68.33,42.84 68.71,43.22 68.83,43.22 69.23,43.22 | HC-05/06/BT12.1 76.83,44.42 74.61,44.42 73.98,43.79 72.24,43.79 71.69,43.24 SJ4.1 69.52,43.22 69.23,43.22 | 69.55,43.04 69.41,43.04 69.23,43.22
D25  (via drill 0.3)
  Top 0.152: v78.74,50.37 JP6.5 | v44.45,50.77 44.45,49.82 43.81,49.19 43.81,46.65 43.18,46.01 43.18,41.88 42.86,41.57 42.86,26.96 44.13,25.69 44.13,16.8 43.81,16.48 43.81,14.26 v43.5,13.95 | v33.97,10.83 v33.97,13.95 | v30.48,10.22 30.48,10.45 30.8,10.77 30.8,16.17 30.48,16.48 v30.48,20.3 | v27.62,20.61 26.67,19.66 v26.67,17.44 | v23.81,17.44 24.13,17.44 24.13,18.71 24.77,19.34 24.77,23.15 TEENSY-3.1/3.2.25
  Bottom 0.152: v78.74,50.37 78.19,49.82 73.03,49.82 72.69,49.49 69.98,49.49 69.33,50.14 64.83,50.14 63.88,49.19 52.7,49.19 51.44,50.46 44.77,50.46 v44.45,50.77 | v43.5,13.95 43.18,13.63 34.29,13.63 v33.97,13.95 | v30.48,10.22 30.79,10.22 31.39,10.83 v33.97,10.83 | v30.48,20.3 30.16,20.61 v27.62,20.61 | v23.81,17.44 v26.67,17.44
D32  (via drill 0.3)
  Top 0.152: v81.28,47.28 JP6.6 | v32.38,46.65 32.7,46.33 32.7,35.22 31.43,33.95 31.43,33.31 31.11,33 31.11,29.82 v31.43,29.5 | v23.81,28.55 24.77,27.6 24.77,26.01 TEENSY-3.1/3.2.32
  Bottom 0.152: v81.28,47.28 80.01,47.28 79.44,46.71 68.67,46.71 68.1,46.14 68.1,44.64 67.36,43.9 64.77,43.9 64.03,44.64 64.03,46.61 64.01,46.64 64.01,46.71 63.44,47.28 57.15,47.28 56.2,46.33 55.56,46.33 54.93,46.97 43.5,46.97 43.18,46.65 v32.38,46.65 | v31.43,29.5 27.94,29.5 26.99,28.55 v23.81,28.55
D33  (via drill 0.3)
  Top 0.152: v84.52,48.96 84.48,48.96 83.82,49.62 JP6.7 | v74.61,50.46 v74.61,48.87 | v54.61,46.33 v54.61,49.82 | v8.57,48.86 8.57,47.28 9.21,46.65 9.21,46.01 9.53,45.7 9.53,37.41 v8.71,36.61 | v13.72,35.6 13.02,34.9 13.02,25.37 v12.7,25.06 | v19.65,28.91 19.61,28.87 19.02,28.87 18.41,28.26 v18.41,25.37
  Bottom 0.152: v84.52,48.96 84.29,49.19 74.93,49.19 v74.61,48.87 | v74.61,50.46 74.3,50.14 72.71,50.14 72.36,49.8 70.1,49.8 69.44,50.46 64.64,50.46 63.69,49.51 54.93,49.51 v54.61,49.82 | v54.61,46.33 54.61,46.65 43.81,46.65 43.5,46.33 33.02,46.33 32.7,46.01 28.26,46.01 26.99,47.28 26.04,47.28 25.08,48.23 23.5,48.23 23.48,48.25 18.49,48.25 17.88,48.86 v8.57,48.86 | v8.71,36.61 8.97,36.87 12.45,36.87 v13.72,35.6 | v12.7,25.06 15.88,25.06 16.19,24.74 17.78,24.74 v18.41,25.37 | v19.65,28.91 21.59,26.96 21.59,26.01 21.91,26.01 TEENSY-3.1/3.2.33
  Bottom 0.203: SJ7.2 88.01,49.7 86.87,49.7 86.12,48.95 85.43,48.95 85.42,48.96 v84.52,48.96
ESP8266_RXD  (via drill 0.3, 0.35)
  Top 0.152: JP1.1 68.58,45.38 v68.96,45.76 | MDL1.15 87.66,25.18 88.9,25.18 89.03,25.31 89.03,35.25 89.4,35.62 89.81,35.62 90.55,36.36 90.55,42.33 91.06,42.84 v91.06,43.47
  Bottom 0.152: v68.96,45.76 69.28,46.08 83.68,46.08 84.26,46.66 89.92,46.66 90.93,45.64 90.93,43.47 v91.06,43.47 94.74,43.47 96.01,44.74 JP8.8
ESP-RST  (via drill 0.3)
  Top 0.152: 69.53,26.64 69.85,26.96 70.8,26.96 MDL1.1 | 70.48,41.25 68.9,41.25 68.9,27.28 69.53,26.64 | 70.48,41.25 ESP-RST.4 | v83.5,42.84 v83.52,47.52 | RN5.2 69.53,25.81 69.53,26.64 | v72.83,42.71 71.37,41.25 70.48,41.25
  Bottom 0.152: v83.52,47.52 83.54,47.52 83.78,47.28 JP8.5 | v83.5,42.84 83.19,42.52 72.9,42.52 v72.83,42.71
ESP_SPI0__MOSI  (via drill 0.3)
  Top 0.152: v82.23,27.47 82.23,11.09 MDL1.21
  Bottom 0.152: v82.23,27.47 82.55,27.47 82.68,27.6 89.53,27.6 91.44,29.5 JP8.19
ESP_SPI0_CSO  (via drill 0.3)
  Top 0.152: v74.3,16.17 73.98,15.85 73.98,11.09 MDL1.17 | v98.11,15.53 98.11,21.25 97.79,21.57 97.79,29.82 96.52,31.09 JP8.18
  Bottom 0.152: v74.3,16.17 74.61,16.48 85.09,16.48 85.41,16.17 93.03,16.17 93.66,15.53 v98.11,15.53
ESP_SPI0_MISO  (via drill 0.3)
  Top 0.152: v76.2,23.79 76.2,11.09 MDL1.18 | v85.72,25.69 v85.72,23.79
  Bottom 0.152: v76.2,23.79 76.52,24.11 85.41,24.11 v85.72,23.79 | v85.72,25.69 86.36,26.33 89.53,26.33 89.85,26.01 93.34,26.01 93.66,25.69 94.3,25.69 95.57,26.96 JP8.22
ESP_SPI0_SCLK  (via drill 0.3)
  Top 0.152: v83.82,26.33 84.14,26.01 84.14,18.71 83.82,18.39 83.82,17.75 84.14,17.44 84.14,11.09 MDL1.22
  Bottom 0.152: v83.82,26.33 84.77,26.33 85.41,26.96 90.17,26.96 90.49,26.64 91.76,26.64 93.03,27.91 93.34,27.91 93.66,28.23 94.3,28.23 95.57,29.5 JP8.20
GND  (via drill 0.3, 0.35, 0.45)
  Top 0.152: 74.17,45.7 LED10.C | 4.76,45.7 PWR.C | 4.76,47.28 D13.C | 4.45,34.9 Q4.1 | 11.43,54.59 RESET.2 | 70.8,36.8 ESP-RST.2 | 80.96,41.25 ESP-PGM.4 | 87.31,12.99 MDL1.9 | 71.44,6.96 C8.- | 27.62,9.5 C1.- | v67.54,17.46 67.56,17.09 RN4.3
  Top 0.305: 4.76,45.7 4.76,45 5.4,44.36 6.1,44.36 v6.18,44.29 | 4.76,47.28 4.76,47.9 5.63,48.77 v5.91,48.77 | 4.45,34.9 4.45,35.12 5.05,35.73 5.46,35.73 v5.51,35.69 | 11.43,54.59 11.43,53.38 11.38,53.33 v11.38,53.19 | 80.96,41.25 81.44,41.25 81.58,41.11 v82.68,41.11 | 87.31,12.99 87.43,12.89 87.73,12.59 87.73,11.82 v87.78,11.74 | 71.44,6.96 v71.45,4.39 | 27.62,9.5 v27.62,10.53 | ESP-RST.2 70.5,37.74 v70.54,37.78 | 64.81,23.03 v64.83,23.05 | 67.59,13.13 C5.1 68.16,13.51 | 68.71,12.07 v68.73,12.04 | 59.79,14.06 59.79,14.03 | C6.- 89.68,21.88 v88.77,21.88 88.65,21.88 | C7.1 90.55,15.53 v91.63,15.53 | v73.01,45.09 73.01,45.36 73.34,45.7 74.17,45.7
  Top 0.406: IC1.1 64.95,22.78 64.81,22.92 64.81,23.03 | 68.16,13.51 68.71,12.97 68.71,12.07 | C4.1 59.51,14.34 59.79,14.06 | 59.79,14.03 v59.87,13.96 | IC2.1 49.38,19.24 v48.37,18.24 48.39,18.22 48.39,13.63 49.4,12.61 C2.1 51.12,12.6 C3.1
  Bottom 0.152: SJ3.1 8.6,38.23 8.56,38.27 v6.41,38.27 | SJ2.1 8,42.2 8,43.52 v8.09,43.61 | SJ1.1 8,46.67 8,47.69 v7.99,47.7
  Bottom 0.406: CR2032.NEGATIVE 54.1,37.63 v56.13,35.6
  pour GND (isolate 0.305, rank 2): 0.03,0.01 -0.13,55.51 arc-90 0.87,56.51 98.82,56.54 arc-90 99.82,55.54 99.72,1 arc-90 98.72,0
GPIO0  (via drill 0.3)
  Top 0.152: v85.09,17.44 85.09,18.39 85.41,18.71 87,18.71 MDL1.12 | v79.57,35.41 79.57,35.66 80.77,36.87 80.9,37.12 80.96,36.49 ESP-PGM.2 | v68.26,34.9 68.58,34.58 68.58,26.01 68.26,25.69 68.26,23.54 68.28,18.56 68.26,18.54 v68.26,18.07 | v68.26,18.07 68.4,18.07 | v68.26,18.07 68.26,15.98 68.53,15.71 RN4.1
  Bottom 0.152: v85.09,17.44 84.77,17.12 71.02,17.12 69.74,18.4 68.59,18.4 v68.26,18.07 | v79.57,35.41 79.38,35.22 68.58,35.22 v68.26,34.9
GPIO2  (via drill 0.3)
  Top 0.152: v85.72,18.07 85.72,17.75 86.36,17.12 86.36,16.8 87,16.8 MDL1.11 | v84.45,26.96 v84.45,18.07 | v90.64,27.27 90.79,27.27 91.12,27.6 91.12,31.73 89.62,33.22 v89.62,34.96
  Bottom 0.152: v84.45,18.07 v85.72,18.07 | v84.45,26.96 84.77,27.28 90.61,27.28 90.63,27.27 v90.64,27.27 | JP8.14 95.89,37.12 94.61,35.85 90.94,35.84 90.5,35.84 v89.62,34.96
GPIO4  (via drill 0.3)
  Top 0.152: v85.72,22.52 85.72,21.25 86.11,20.87 87,20.87 87,20.93 MDL1.13 | v91.76,22.52 92.08,22.84 92.08,32.68 91.76,33 v91.76,38.39
  Bottom 0.152: v91.76,22.52 v85.72,22.52 | v91.76,38.39 94.61,38.39 95.89,39.66 JP8.12
GPIO5  (via drill 0.3)
  Top 0.152: v88.58,23.79 88.52,23.79 88.52,23.03 88.33,22.84 87.31,22.84 MDL1.14 | v91.44,23.79 91.76,24.11 91.76,32.36 91.44,32.68 91.44,37.76 91.12,38.08 v91.12,42.08
  Bottom 0.152: v91.44,23.79 v88.58,23.79 | v91.12,42.08 92.27,40.93 94.61,40.93 95.89,42.2 JP8.10
GPIO9  (via drill 0.3)
  Top 0.152: v78.11,25.69 78.11,11.09 MDL1.19
  Bottom 0.152: v78.11,25.69 84.14,25.69 84.45,26.01 85.09,26.01 85.72,26.64 89.85,26.64 90.17,26.33 92.08,26.33 92.71,26.96 JP8.21
GPIO10  (via drill 0.3)
  Top 0.152: v80.01,25.06 80.01,11.09 MDL1.20 | v89.62,32.04 89.79,32.04 89.98,31.85 89.98,25.53 90.13,25.37 v90.17,25.37
  Bottom 0.152: v80.01,25.06 80.33,24.74 89.53,24.74 v90.17,25.37 | JP8.17 v89.62,32.04
GPIO12  (via drill 0.3)
  Top 0.152: v70.48,28.23 70.8,28.55 70.8,34.9 v71.75,35.85 | MDL1.6 71.12,16.8 73.34,16.8 73.34,22.52 73.03,22.84 73.03,23.79 73.34,24.11 73.34,26.71 v73.6,26.96
  Bottom 0.152: v70.48,28.23 68.9,28.23 68.9,27.28 69.47,26.71 73.28,26.71 73.53,26.96 v73.6,26.96 | v71.75,35.85 72.07,35.53 78.23,35.53 79.82,37.12 JP8.13
GPIO13  (via drill 0.3)
  Top 0.152: v73.66,23.15 73.66,14.9 71.12,14.9 MDL1.7 | v93.03,23.15 93.03,23.79 92.71,24.11 92.71,32.36 93.98,33.63 JP8.15
  Bottom 0.152: v73.66,23.15 86.04,23.15 86.36,22.84 88.9,22.84 91.12,22.84 91.44,23.15 v93.03,23.15
GPIO14  (via drill 0.3)
  Top 0.152: v69.03,22.71 68.58,22.26 68.58,19.46 69.23,18.81 71.03,18.81 71.04,18.8 | v62.55,23.79 62.55,27.28 62.23,27.6 62.23,39.66 v62.55,39.98 | 71.04,18.8 70.8,18.71 | 71.04,18.8 MDL1.5
  Bottom 0.152: v69.03,22.71 67.94,23.79 v62.55,23.79 | v62.55,39.98 69.85,39.98 70.17,39.66 91.12,39.66 91.44,39.98 92.08,39.98 92.39,39.66 JP8.11
GPIO15  (via drill 0.3)
  Top 0.152: v85.72,16.8 85.72,15.21 86.04,14.9 87,14.9 MDL1.10 | v92.41,16.98 v92.39,33.31 | RN4.2 69.37,16.71 69.53,16.87 v69.53,17.73
  Bottom 0.152: JP8.16 95.57,34.58 94.3,33.31 v92.39,33.31 | v92.41,16.98 92.16,16.98 92.05,17.09 86.04,17.12 v85.72,16.8 85.71,16.82 70.5,16.82 69.58,17.73 v69.53,17.73
GPIO16  (via drill 0.3)
  Top 0.152: v69.41,21.82 69.41,21.44 69.98,20.87 70.74,20.87 70.8,20.93 MDL1.4 | v67.94,33.95 68.26,33.63 68.26,26.33 68.07,26.07 67.44,26.07 66.88,25.51 v66.88,22.19 | v63.18,40.62 v63.18,34.27
  Bottom 0.152: v66.88,22.19 68.53,22.19 68.83,21.88 69.34,21.88 v69.41,21.82 | v67.94,33.95 63.5,33.95 v63.18,34.27 | v63.18,40.62 63.5,40.3 70.17,40.3 70.48,39.98 89.22,39.98 90.3,41.06 90.3,42.33 90.68,42.71 93.47,42.71 JP8.9
HC-KEY  (via drill 0.3, 0.35)
  Top 0.152: HC-05/06/BT12.6 89.53,44.11 89.53,42.52 87.95,42.52 86.74,41.31 v86.74,41.25 | HC-PGM.4 57.1,40.22 56.71,40.62 v56.71,41.19
  Top 0.203: v90.55,48.55 90.55,48.3 89.69,47.43 HC-05/06/BT12.6
  Bottom 0.152: v56.71,41.19 57.09,41.57 60.64,41.57 60.96,41.25 69.85,41.25 70.8,40.3 85.79,40.3 v86.74,41.25
  Bottom 0.203: v90.55,48.55 90.3,48.81 SJ7.1
MASTER-RESET  (via drill 0.3)
  Top 0.152: v4.98,50.14 3.85,50.14 3.71,50 3.49,49.82 RESET.3 | 3.2_RST.1 7.94,23.47 7.94,29.18 8.57,29.82 8.57,30.45 8.26,30.77 8.26,33 10.16,34.9 10.16,46.33 9.84,46.65 v9.82,50.44 v9.84,54.59 | JP11.3 33.02,9.4 33.92,10.3 34.19,10.3 34.6,10.71 v35.03,10.71 | v40.64,10.71 41.59,11.66 v41.59,16.48 | v43.5,17.12 43.81,17.12 43.81,24.74 v43.5,25.06 | v47.62,25.37 47.31,25.69 47.31,28.63 47.31,28.99 | v46.99,54.97 46.99,45.7 46.67,45.38 46.67,42.84 46.35,42.52 46.37,42.51 46.37,30.01 46.77,29.6 47.31,29.06 47.31,29.01 | 47.31,29.01 | 47.31,28.99 | 47.31,29.01 47.31,28.99 | 47.31,28.99 47.31,29.01
  Bottom 0.152: 3.2_RST.1 7.94,23.47 11.43,23.47 3.1_RST.1 | v40.64,10.71 v35.03,10.71 | v41.59,16.48 42.23,17.12 v43.5,17.12 | v43.5,25.06 43.71,24.84 47.09,24.84 v47.62,25.37 | v9.84,54.59 10.48,55.22 27.88,55.22 28.19,54.9 46.93,54.9 v46.99,54.97 | v4.98,50.14 6.59,50.14 7.08,50.64 7.52,50.64 7.71,50.44 v9.82,50.44
N$2  (via drill 0.3, 0.35)
  Top 0.152: v16.46,28.65 17.63,29.82 18.43,30.63 18.41,33.95 18.1,34.27 18.1,36.8 RN1.5 | v7.94,40.17 v7.94,30.14 | v2.86,40.3 3.17,40.62 3.17,45.7 2.86,45.7 PWR.A
  Bottom 0.152: v16.46,28.65 16.38,28.65 15.2,29.83 15.2,29.82 8.26,29.82 v7.94,30.14 | v2.86,40.3 7.75,40.3 7.87,40.17 v7.94,40.17
N$3  (via drill 0.3)
  Top 0.152: v3.49,39.66 3.49,46.33 2.86,46.97 D13.A | v15.37,39.47 16,39.47 16.19,39.28 16.76,39.28 RN1.1
  Bottom 0.152: v3.49,39.66 3.68,39.47 v15.37,39.47
N$4  (via drill 0.35)
  Top 0.152: HC-PGM.2 54.66,41.19 v55.37,41.19 | v58.17,42.84 58.17,44.15 R2.1
  Bottom 0.152: v55.37,41.19 56.77,42.58 57.91,42.58 58.04,42.71 58.04,42.84 v58.17,42.84
N$5
  cutout GND: 71.12,34.96 71.12,27.98 87.5,27.98 87.5,34.96
  cutout 5V-FUSE: 71.12,34.96 71.12,27.98 87.5,27.98 87.5,34.96
PGM  (via drill 0.3)
  Top 0.152: JP6.8 86.36,50.2 v85.66,49.51 | v43.81,50.14 43.5,49.82 43.5,46.97 42.86,46.33 42.86,42.2 42.55,41.88 42.55,26.33 v42.86,26.01
  Bottom 0.152: v85.66,49.51 73.34,49.51 73.03,49.19 69.85,49.19 69.2,49.84 65.04,49.84 64.07,48.87 52.39,48.87 51.12,50.14 v43.81,50.14 | v42.86,26.01 34.92,26.01 TEENSY-3.1/3.2.PGM
PWM5  (via drill 0.3)
  Top 0.152: v50.8,42.2 JP5.6 | v41.27,42.2 40.64,41.57 40.64,32.36 41.59,31.41 41.59,23.15 41.91,22.84 41.91,18.07 42.23,17.75 v42.23,12.36 | v17.14,12.04 17.14,15.53 TEENSY-3.1/3.2.5
  Bottom 0.152: v41.27,42.2 v50.8,42.2 | v42.23,12.36 41.91,12.68 29.21,12.68 28.89,12.36 20.32,12.36 20,12.04 v17.14,12.04
PWM6/CS0  (via drill 0.3)
  Top 0.152: v48.26,44.42 JP5.7 | v61.91,26.96 v61.91,44.42 | v19.68,12.68 19.68,15.53 TEENSY-3.1/3.2.6 | v44.13,12.68 44.13,16.17 44.45,16.48 44.45,26.33 v44.13,26.64
  Bottom 0.152: v48.26,44.42 48.58,44.74 60.33,44.74 60.64,44.42 v61.91,44.42 | SPI.5 v61.91,26.96 61.28,26.96 60.96,26.64 46.37,26.64 46.35,26.62 45.83,26.62 45.8,26.64 v44.13,26.64 | v19.68,12.68 28.57,12.68 28.89,12.99 43.81,12.99 v44.13,12.68
PWM7/RX3/A-MOSI  (via drill 0.3)
  Top 0.152: v81.92,48.23 81.92,44.42 HC-05/06/BT12.3 | v75.56,43.47 v75.56,48.23 | JP5.8 v45.72,43.47 45.72,29.85 45.38,29.5 45.38,26.94 45.09,26.64 45.09,16.48 45.4,16.17 45.4,13.95 45.09,13.63 45.09,6.26 v44.51,5.69 | v25.4,29.82 25.4,30.14 25.72,30.45 25.72,33 24.77,33.95 24.77,35.22 RN8.1 | v28.26,33.63 v28.26,30.14 | v34.29,33.63 33.97,33.95 33.97,42.2 v34.29,42.52 | v26.35,13.31 29.53,10.13 29.53,7.28 28.89,6.64 v28.89,5.69
  Bottom 0.152: v75.56,48.23 v81.92,48.23 | v75.56,43.47 72.52,43.47 71.5,42.46 62.36,42.46 61.02,43.79 60.96,43.79 60.83,43.79 60.01,43.79 59.69,44.11 49.53,44.11 48.9,43.47 v45.72,43.47 45.4,43.79 41.27,43.79 40.32,42.84 34.61,42.84 v34.29,42.52 | v25.4,29.82 27.62,29.82 27.94,30.14 v28.26,30.14 | v34.29,33.63 v28.26,33.63 | v26.35,13.31 23.5,13.31 23.5,14.26 22.23,15.53 TEENSY-3.1/3.2.7 | v28.89,5.69 29.84,5.69 30.16,6.01 44.2,6.01 v44.51,5.69
PWM/D9/RX2  (via drill 0.3)
  Top 0.152: RN3.3 25.08,43.79 24.78,43.79 23.38,45.19 v23.33,45.19 | JP4.2 39.05,52.36 v39.05,44.42 39.05,33.31 38.73,33 38.73,19.66 v39.05,19.34 | v27.3,19.34 27.3,15.85 TEENSY-3.1/3.2.9
  Bottom 0.152: v27.3,19.34 v39.05,19.34 JP8.27 | v23.33,45.19 23.33,45.16 24.07,44.42 v39.05,44.42
PWM/D10/TX2  (via drill 0.3)
  Top 0.152: v25.4,41.57 25.4,42.84 RN3.4 | 36.51,45.7 36.51,52.36 JP4.3 | 36.51,45.7 v36.51,41.25 | v31.75,41.25 31.75,35.92 30.8,34.96 30.8,21.57 29.84,20.61 29.84,15.85 TEENSY-3.1/3.2.10 | JP8.28 96.52,18.39 95.25,17.12 95.25,13.95 94.3,12.99 93.66,12.99 93.34,12.68 v93.03,12.68 | v80.64,13.63 80.33,13.95 80.33,19.98 v80.64,20.3 | v46.35,46.01 46.35,43.16 46.04,42.84 46.05,29.88 47,28.93 46.99,24.74 46.99,21.57 v45.72,20.3 | 36.51,45.7 v37.47,45.7
  Bottom 0.152: v25.4,41.57 27.3,41.57 27.62,41.25 v31.75,41.25 v36.51,41.25 | v93.03,12.68 89.22,12.68 88.9,12.99 88.58,12.99 87.95,13.63 v80.64,13.63 | v80.64,20.3 80.33,19.98 46.04,19.98 v45.72,20.3 | v46.35,46.01 46.04,45.7 v37.47,45.7
RX1_LED_RES
  Top 0.152: RN7.2 16.51,43.47 15.88,43.47 15.88,45.06 15.56,45.38 14.61,45.38 RXD1.A
RX1_Q1B_GATE  (via drill 0.3)
  Top 0.152: 22.23,45.7 22.23,43.79 RN6.5 | 22.23,45.7 20.95,45.7 20.32,45.06 Q1.5 | v26.35,46.33 26.35,45.38 RN3.8 | 22.23,45.7 v22.23,46.33
  Bottom 0.152: v22.23,46.33 v26.35,46.33
RX1_TX1_RX2_TX2_PU_SJ  (via drill 0.3)
  Top 0.152: RN6.1 24.13,41.25 24.13,41.88 RN6.2 24.13,42.2 | 24.13,42.2 24.13,42.84 | 24.13,42.84 24.13,43.47 RN6.4 | 24.13,42.84 RN6.3 | v27.94,41.88 28.57,41.88 28.89,42.2 SJ5.1 | 24.13,42.2 v24.77,42.2
  Bottom 0.152: v27.94,41.88 27.62,42.2 v24.77,42.2
RX1L  (via drill 0.3)
  Top 0.152: v17.46,41.25 17.46,43.16 17.78,43.47 18.1,43.47 RN7.7 | v21.59,41.25 21.27,41.57 21.27,42.52 20.95,42.84 20.95,43.16 Q1.3
  Bottom 0.152: v21.59,41.25 v17.46,41.25
RX2_LED_RES
  Top 0.152: RN7.4 16.51,41.88 16.51,41.25 16.19,40.93 14.61,40.93 RXD2.A
RX2_Q2B_GATE  (via drill 0.3)
  Top 0.152: v23.18,40.62 23.18,41.57 22.86,41.88 22.54,41.88 RN6.7 | v26.99,40.93 26.99,42.2 27.3,42.52 27.3,43.16 26.67,43.79 RN3.6 | v18.73,40.62 19.68,40.62 20,40.93 Q2.5
  Bottom 0.152: v26.99,40.93 23.5,40.93 v23.18,40.62 v18.73,40.62
RX2L  (via drill 0.3)
  Top 0.152: v21.02,37.76 20.95,37.88 20.95,39.03 20.64,39.34 Q2.3 | v17.78,40.3 18.1,40.62 18.1,41.88 RN7.5
  Bottom 0.152: v21.02,37.76 19.05,37.76 17.78,39.03 v17.78,40.3
RX3_LED_RES
  Top 0.152: RN1.3 16.51,37.76 15.46,37.76 15.24,37.55 15.24,37.12 14.92,36.8 14.61,36.8 RXD3.A
RX3_Q3B_GATE  (via drill 0.3)
  Top 0.152: 26.67,38.08 26.7,38.06 | 26.7,38.06 RN9.4 | v21.51,38.6 21.91,38.2 21.91,37.12 Q3.5 | v24.45,37.76 24.45,36.8 RN8.4 24.77,36.8 25.4,37.44 25.91,37.44 25.97,37.44 26.61,37.44 26.7,37.53 26.7,38.06
  Bottom 0.152: v24.45,37.76 22.35,37.76 v21.51,38.6
RX3L  (via drill 0.3)
  Top 0.152: v17.78,33.63 17.46,33.95 17.46,37.44 17.78,37.76 18.1,37.76 RN1.6 | v22.86,33.63 22.86,34.58 22.54,34.9 22.54,35.22 Q3.3
  Bottom 0.152: v22.86,33.63 v17.78,33.63
SCL0-3/A5/D19  (via drill 0.3)
  Top 0.152: JP9.6 63.5,7.59 63.18,7.91 v63.18,11.09 | v20.64,11.72 20.64,28.56 v21.59,29.52
  Bottom 0.152: v63.18,11.09 63.15,11.12 62.87,11.4 62.8,11.47 54.82,11.47 54.76,11.53 42.42,11.53 | 42.42,11.53 | v20.64,11.72 20.95,12.04 29.21,12.04 29.53,12.36 41.4,12.36 42.23,11.53 42.42,11.53 | TEENSY-3.1/3.2.19/A5 20.03,31.08 v21.59,29.52
SCL1/A18/D29  (via drill 0.3)
  Top 0.152: v18.72,49.49 18.73,52.36 JP4.10 | v33.97,49.19 33.66,48.87 33.66,29.82 v33.97,29.5 | v32.38,29.5 32.38,26.01 TEENSY-3.1/3.2.29
  Bottom 0.152: v18.72,49.49 18.77,49.49 19.07,49.19 21.59,49.19 21.91,49.51 32.7,49.51 33.02,49.19 v33.97,49.19 | v32.38,29.5 v33.97,29.5
SDA0-3/A4/D18  (via drill 0.3)
  Top 0.152: v23.18,19.66 23.18,27.91 22.23,28.87 22.23,30.77 TEENSY-3.1/3.2.18/A4 | v18.41,19.66 18.41,12.68 20.64,10.45 v20.64,8.99 | JP9.5 v60.96,8.87
  Bottom 0.152: v23.18,19.66 22.86,19.34 18.73,19.34 v18.41,19.66 | v20.64,8.99 20.83,8.8 24.51,8.8 25.08,8.23 38.73,8.23 39.69,9.18 40.32,9.18 40.96,8.55 50.04,8.55 50.35,8.87 v60.96,8.87
SDA1/A19/D30  (via drill 0.3)
  Top 0.152: v21.3,50.24 21.27,52.36 JP4.9 | v33.34,28.87 v33.34,49.82 | v29.84,28.87 29.84,26.01 TEENSY-3.1/3.2.30
  Bottom 0.152: v33.34,49.82 22.35,49.84 21.95,50.24 v21.3,50.24 | v29.84,28.87 v33.34,28.87
SER1_TRC  (via drill 0.3)
  Top 0.152: TXD1.C 12.38,46.65 12.38,45.38 RXD1.C 12.06,45.38 11.43,45.38 11.11,45.7 v11.11,46.01
  Bottom 0.152: v11.11,46.01 9.84,46.01 SJ1.2
SER2_TRC  (via drill 0.3)
  Top 0.152: TXD2.C 12.38,42.52 12.38,41.25 RXD2.C 12.06,40.93 11.43,40.93 11.11,41.25 v11.11,41.57
  Bottom 0.152: v11.11,41.57 9.84,41.57 SJ2.2
SER3_TRC  (via drill 0.3)
  Top 0.152: RXD3.C 12.38,37.12 12.38,38.39 TXD3.C 12.06,38.71 11.43,38.71 11.11,38.39 v11.11,37.95
  Bottom 0.152: v11.11,37.95 11.05,38.01 10.67,38.01 10.54,37.88 9.78,37.88 SJ3.2
STA_LED_RES
  Top 0.152: R1.1 71.37,43.41 73.6,43.41 73.98,43.79 LED10.A
STA_LED_TRC  (via drill 0.35)
  Top 0.152: v69.47,45.02 70.86,45.02 70.93,44.95
  Top 0.203: 70.59,45.28 70.99,44.87 70.93,44.95 R1.2
  Bottom 0.152: 69.6,44.49 69.37,44.26 SJ4.2 69.55,44.94 v69.47,45.02
TEENSY_3V3  (via drill 0.3)
  Top 0.305: v6.73,34.24 6.73,31.24
  Top 0.406: 6.73,31.24 TEENSY-3.1/3.2.3.3V
  Bottom 0.305: TEENSY-3.1/3.2.3.3V1 32.85,20.92 32.77,20.84 31.42,20.84 31.04,21.22 31.04,24.45 30.79,24.7 20.89,24.7 TEENSY-3.1/3.2.3.3V2 19.6,27.28 17.45,29.43 16.76,29.43 15.8,30.39 15.8,33.06 14.78,34.07 7.11,34.07 6.97,34.21 6.95,34.21 6.76,34.28 6.82,34.28 v6.73,34.24
TEENSY_RX1  (via drill 0.3)
  Top 0.152: v88.2,34.2 88.2,27.15 88.14,27.09 87.95,26.96 87.31,26.96 MDL1.16 | v92.39,46.01 v92.39,34.58 | v25.4,46.97 25.4,45.38 RN3.1 | JP5.1 v63.5,46.39 | v4.45,25.6 4.45,15.85 TEENSY-3.1/3.2.0 | v10.48,47.84 v10.48,26.01
  Bottom 0.152: v92.39,34.58 92.2,34.33 88.33,34.33 v88.2,34.2 | JP8.6 95.89,47.28 94.61,46.01 v92.39,46.01 91.44,46.97 84.14,46.97 83.55,46.38 68.77,46.38 68.4,46.01 68.4,44.44 67.56,43.6 64.2,43.6 62.1,45.7 | v10.48,26.01 4.79,26.01 4.45,25.67 v4.45,25.6 | v10.48,47.84 18.03,47.84 18.81,47.07 25.3,47.07 v25.4,46.97 26.67,46.97 28.57,45.06 38.1,45.06 38.42,45.38 60.33,45.38 60.64,45.7 62.1,45.7 | 62.1,45.7 62.8,46.39 v63.5,46.39
TEENSY_TX1  (via drill 0.3)
  Top 0.152: JP5.2 60.97,45.39 61.15,45.21 v61.15,45.06 61.21,45 63.25,45 JP1.2 | RN3.2 25.08,44.42 24.67,44.84 24.67,45.08 v24.32,45.43 | v6.99,19.34 6.99,15.85 TEENSY-3.1/3.2.1 | v39.37,20.3 39.05,20.61 39.05,32.68 39.37,33 39.37,43.79 40.01,44.42 v40.01,44.74
  Bottom 0.152: v61.15,45.06 40.01,45.06 | 40.01,45.06 38.73,45.06 38.42,44.74 24.77,44.74 24.77,44.98 v24.32,45.43 | v6.99,19.34 12.06,19.34 12.38,19.02 26.04,19.02 26.99,19.98 27.62,19.98 27.94,19.66 38.42,19.66 39.05,20.3 v39.37,20.3 | 40.01,45.06 v40.01,44.74
TX1_LED_RES
  Top 0.152: RN7.1 16.51,44.42 16.19,44.42 16.19,46.65 15.88,46.97 14.61,46.97 TXD1.A
TX1_Q1A_GATE  (via drill 0.3)
  Top 0.152: v21.59,43.16 21.59,42.84 22.23,42.84 RN6.6 | v19.05,44.11 20.23,44.11 20.32,44.02 20.32,43.47 Q1.2 | RN3.7 27.41,44.53 v28.16,43.79
  Bottom 0.152: v21.59,43.16 22.23,43.79 22.86,43.79 | v28.16,43.79 26.8,43.79 22.86,43.79 | v19.05,44.11 19.68,44.74 21.91,44.74 22.86,43.79
TX1L
  Top 0.152: 19.68,44.74 Q1.6 18.52,44.78 RN7.8
TX2_LED_RES
  Top 0.152: RN7.3 16.51,42.84 14.61,42.84 TXD2.A
TX2_Q2A_GATE  (via drill 0.3)
  Top 0.152: v22.54,39.98 22.54,41.25 RN6.8 | RN3.5 26.67,42.84 26.67,41.42 25.58,40.32 v24.88,40.32 v24.87,40.34 | v20,38.71 Q2.2
  Bottom 0.152: v20,38.71 21.27,39.98 v22.54,39.98 24.14,39.98 24.21,39.98 24.51,39.98 v24.87,40.34
TX2L
  Top 0.152: RN7.6 18.41,42.84 19.05,42.2 19.05,41.88 19.37,41.57 19.37,41.25 Q2.6
TX3_LED_RES
  Top 0.152: RN1.2 16.51,38.71 14.61,38.71 TXD3.A
TX3_Q3A_GATE  (via drill 0.3)
  Top 0.152: v22.23,34.27 21.91,34.58 21.91,35.22 Q3.2 | 25.4,35.22 RN8.2 26.33,35.18 26.54,34.96 v26.54,34.27 | v23.56,34.27 23.56,37.82 24.13,38.39 24.77,38.39 25.08,38.08 25.72,38.08 RN9.3
  Bottom 0.152: v22.23,34.27 v23.56,34.27 v26.54,34.27
TX3_RX3_PU_SJ
  Top 0.152: RN9.2 25.72,39.34 26.67,39.34 RN9.1 26.92,39.27 SJ6.2
TX3L  (via drill 0.3)
  Top 0.152: v18.73,36.17 19.05,36.49 19.05,37.76 18.41,38.39 RN1.7 | v20.64,36.17 21.27,36.8 Q3.6
  Bottom 0.152: v20.64,36.17 v18.73,36.17
VBAT  (via drill 0.3)
  Top 0.152: v38.73,18.39 38.42,18.71 38.41,32.51 38.41,32.93 38.15,33.19 v37.63,33.19
  Bottom 0.152: CR2032.POSITIVE@1 60.33,39.03 60.33,36.17 CR2032.POSITIVE@2 60.33,35.85 60.33,33 37.82,33 v37.63,33.19 38.06,33.15 38.1,33.19 38.1,35.85 CR2032.POSITIVE@4 38.1,36.17 38.1,39.03 CR2032.POSITIVE@3 | v38.73,18.39 34.92,18.39 TEENSY-3.1/3.2.VBAT
VIN  (via drill 0.35)
  Top 0.305: 24.11,8.85 23.66,9.3 C1.+ | 56.11,18.47 56.23,18.59 56.12,18.69 IC2.3 | 55.93,16.35 55.89,16.38
  Top 0.406: C3.2 53.48,15.82 54.04,16.38 55.89,16.38 56.11,16.6 56.11,18.47 | D1.P$1 20.35,8.27 20.83,7.79 22.73,7.79 22.92,7.98 C1.+ 24.07,10.45 24.51,10.45 24.54,10.48 v24.77,10.48 | v57.02,9.94 57.02,12.37 55.93,13.46 55.93,16.35
  Bottom 0.406: v24.77,10.48 24.77,10.58 26.04,9.31 38.23,9.31 38.9,9.98 41.11,9.98 41.67,9.42 49.52,9.42 50.04,9.94 v57.02,9.94
VIN2_GND
  Bottom 0.305: 19.63,4.18 VIN.1
  Bottom 0.406: X1.1 10.58,4.86 12.79,7.07 15.28,7.07 16.94,5.41 16.94,4.88 17.64,4.18 19.63,4.18
VIN+  (via drill 0.35)
  Top 0.305: v16.85,6.67 16.85,6.83 | 16.48,7.2 16.48,7.74 L1.2
  Top 0.406: X1.2 14.46,9.87 L1.2 | 16.85,6.83 16.48,7.2 | JP11.8 46.99,5.37 46.99,7.4 v46.86,7.53
  Bottom 0.406: 22.48,5.5 VIN.2 22.48,6.01 22.35,6.13 | v16.85,6.67 17.02,6.49 17.37,6.13 22.35,6.13 | v46.86,7.53 45.72,7.53 45.59,7.66 37.67,7.66 37.61,7.72 28.64,7.72 26.04,5.12 24.51,5.12 23.5,6.13 22.35,6.13
VIN_FER_DIO
  Top 0.305: L1.1 16.77,9.99 | D1.P$2
  Top 0.406: 16.77,9.99 17.4,10.62 D1.P$2
VUSB  (via drill 0.35)
  Top 0.305: 2.22,35.85 Q4.3
  Top 0.406: Q4.3 2.23,35.03 1.78,34.58 v1.78,34.46
  Bottom 0.406: TEENSY-3.1/3.2.VUSB 4.13,28.55 3.05,29.63 3.05,33.19 v1.78,34.46

## Text on the board
tPlace: PGM | 9 | 8 | 7 | 6 | 5 | 4 | 3 | 2 | 1 | 0 | TEENSY / TX1 | (T) | (T) | 13 | 12 | 11 | 10 | (P) | (P) | 24 | 25 | (P) | 32 | (P) | 33 | (T) | A16 | A17 | A20 | (P) | (P) | (P) | (T) | (T) | ESP / RXD | (P) | DAC | (T) | (T) | (T) | (T) | (T) | (P) | (T) | (T) | A0 | A1 | A2 | A3 | A4 | A5 | 6 | (P) | A7 | A8 | (P) | A9 | (P) | A10 | A11 | A12 | A13 | A14 | A15
bPlace: https://www.tindie.com/stores/cburgess129 | RST | TX1 | ADC | RX1 | STA | RXD | TXD | GND | 3V3 | KEY | IO16 | IO5 | IO14 | IO4 | IO12 | IO2 | IO13 | IO15 | IO10 | CS0 | MOSI | SCK | IO9 | MISO | GND | 3V3 | D9 | D10 | D11 | D13 | D12 | D2
tNames: 5V | 3V3 | TX | SCL | SDA | GND | Q1 | AREF | RN3 | RX | RN7 | RN6 | RX2 | TX3 | RX3 | SCK | MOSI | TX2 | TX1 | RX1 | MISO | STATE | CAN-RX | CAN-TX | CS | Q2 | RN9 | Arduino- | Q4 | Q3 | RN1 | SERIAL | Teensy | RN8 | ESP-GPIO | +ESP-12E | 1 | R5.0 | ESP | ENA | ESP-SPI0 | RN5 | GND | 1 | RN4 | C7 | NRF24L01+ | GND | IOREF | RESET | 3V3 | 5V | GND | VIN | VIN: / 6.5-12V | - | +
bNames: 5V | 3V3 | HC-05/06/BT12 | COMMS: | ESP8266 : RX1/TX1 | ESP-GPIO | HC05/06 : RX3/TX3 | LINK->D33 STATE->D24 | 5V | GND | 3V3 | NRF24L01 : HW SPI | CE->D9 CSN->D10 | VUSB | ESP-SPI0 | 3.2_RST | 3V3 | PGM | 3V3 | GND | 3.1_RST | GND | VBAT | GND | NRF24L01+ | VIN Voltage | GND | 6.5 - 12VDC | REV 5.0 | 2/2018